# Altium schematic sheet 充电安全回路.SchDoc
size A4; SheetNumber: 6; SheetTotal: 9
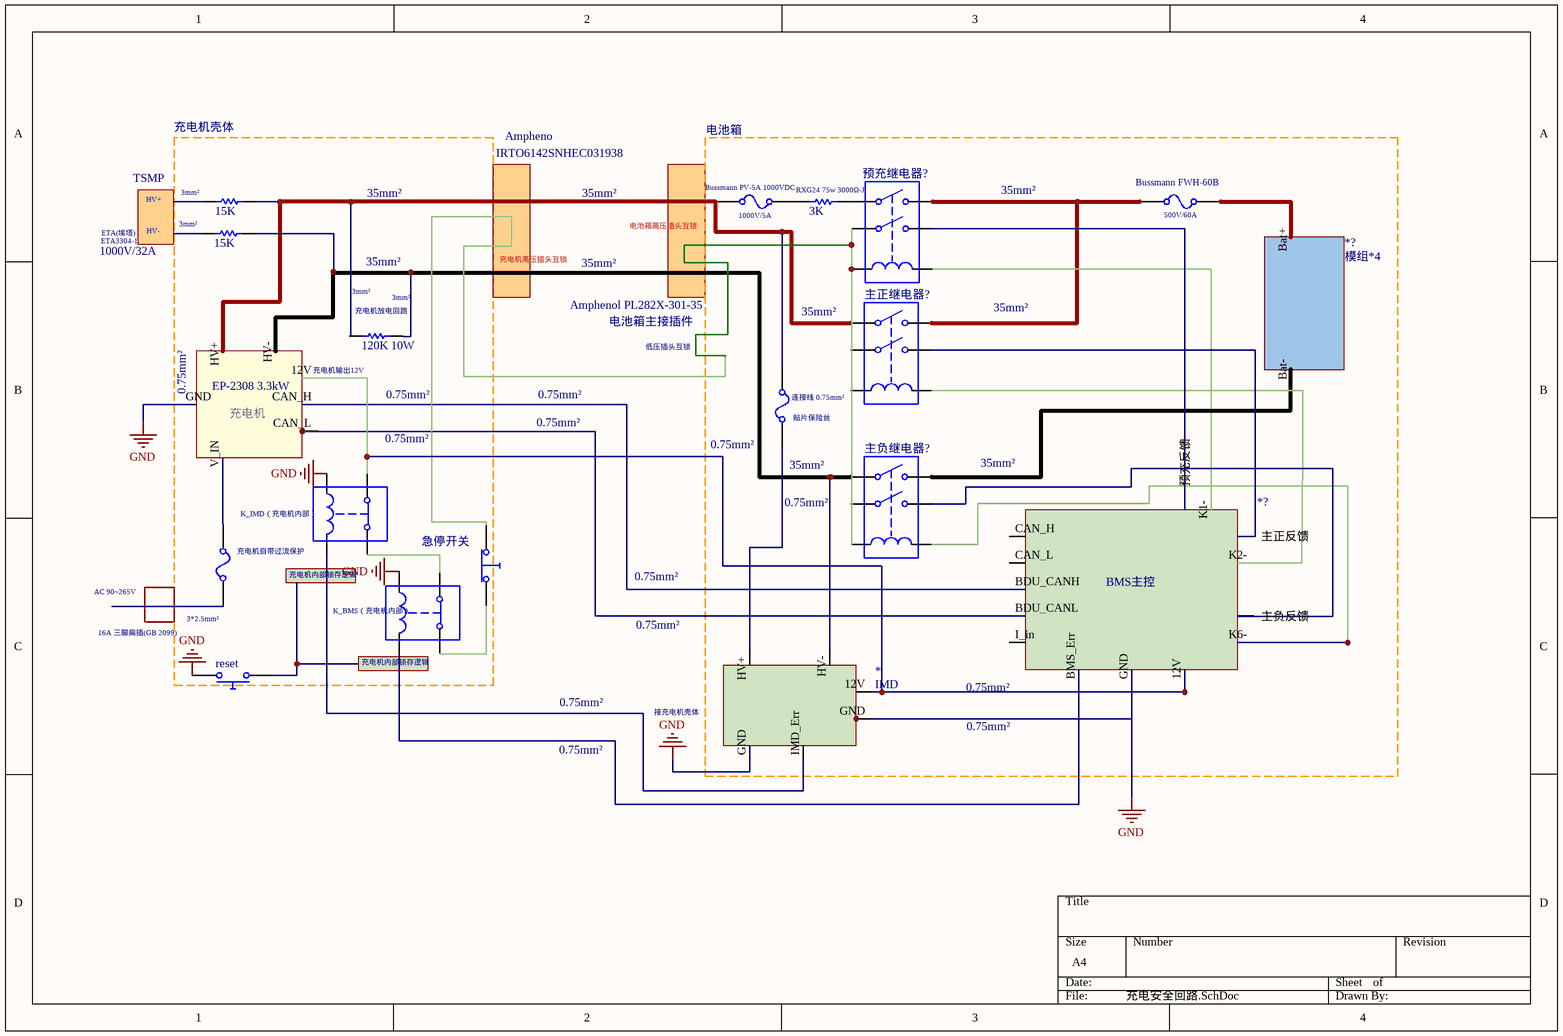
[diagram p0: 充电安全回路.SchDoc]

## Parts
(Parts that share a designator on the sheet are numbered #1, #2 ... from top to bottom, then left to right.)
*  IMD
*?#1  模组*4
*?#2  EP-2308 3.3kW
*?#3  BMS主控
?  value 120K 10W  (hidden comment: Resistor)
Bussmann_FWH-60B  Fuse  (value not drawn)
Bussmann_PV-5A_1000VDC  Fuse  (value not drawn)
K_BMS（充电机内部）  Single-Pole, Single-Throw Normally Closed Relay  (value not drawn)
K_IMD（充电机内部）  Single-Pole, Single-Throw Normally Closed Relay  (value not drawn)
R?#1  value 15K  (hidden comment: Resistor)
R?#2  value 15K  (hidden comment: Resistor)
reset  Push Button Normally Opened  (value not drawn)
RXG24_75w_3000Ω-J  value 3K  (hidden comment: Resistor)
主正继电器?  Double-Pole, Single-Throw Relay  (value not drawn)
主负继电器?  Double-Pole, Single-Throw Relay  (value not drawn)
充电机自带过流保护  Fuse  (value not drawn)
急停开关  Push Button Normally Closed  (value not drawn)
贴片保险丝  连接线 0.75mm²
预充继电器?  Double-Pole, Single-Throw Relay  (value not drawn)

## Nets
GND: *.GND *?#2.GND *?#3.GND K_BMS（充电机内部）.3 K_IMD（充电机内部）.3 reset.2
Net*?#1_Bat+: *?#1.Bat+ Bussmann_FWH-60B.2
Net*?#1_Bat-: *?#1.Bat- 主负继电器?.2
Net*?#2_CAN_H: *?#2.CAN_H *?#3.BDU_CANH
Net*?#2_CAN_L: *?#2.CAN_L *?#3.BDU_CANL
Net*?#2_HV+: *?#2.HV+ ?.1 Bussmann_PV-5A_1000VDC.1 R?#1.2 主正继电器?.1 贴片保险丝.2
Net*?#2_V_IN: *?#2.V_IN 充电机自带过流保护.2
Net*?#3_?1: *?#3.?1(主负反馈) 主负继电器?.4
Net*?#3_?2: *?#3.?2(主正反馈) 主正继电器?.4
Net*?#3_?3: *?#3.?3(预充反馈) 预充继电器?.4
Net*?#3_BMS_Err: *?#3.BMS_Err K_BMS（充电机内部）.4
Net*?#3_K1-: *?#3.K1- 预充继电器?.6
Net*?#3_K2-: *?#3.K2- 主正继电器?.6
Net*?#3_K6-: *?#3.K6- 主负继电器?.6
Net*_12V: *.12V *?#2.12V *?#3.12V K_IMD（充电机内部）.1
Net*_HV+: *.HV+ 贴片保险丝.1
Net*_HV-: *.HV- *?#2.HV- ?.2 R?#2.1 主负继电器?.1
Net*_IMD_Err: *.IMD_Err K_IMD（充电机内部）.4
NetBussmann_FWH-60B_1: Bussmann_FWH-60B.1 主正继电器?.2 预充继电器?.2
NetBussmann_PV-5A_1000VDC_2: Bussmann_PV-5A_1000VDC.2 RXG24_75w_3000Ω-J.1
NetK_BMS（充电机内部）_1: K_BMS（充电机内部）.1 K_IMD（充电机内部）.2
NetK_BMS（充电机内部）_2: K_BMS（充电机内部）.2 急停开关.2
NetRXG24_75w_3000Ω-J_2: RXG24_75w_3000Ω-J.2 预充继电器?.1
Net主负继电器?_5: 主负继电器?.5 急停开关.1 预充继电器?.3 预充继电器?.5

Not connected (* = marked no-connect by the designer): *?#3 CAN_H CAN_L I_in; R?#1 1; R?#2 2; reset 1; 主正继电器? 3 5; 主负继电器? 3; 充电机自带过流保护 1

## Notes on the sheet
- TSMP
- 充电机壳体
- IRTO6142SNHEC031938
- Ampheno
- 电池箱
- ETA3304-1
- ETA(埃塔)
- HV+
- HV-
- (near R?#2) 3mm²
- (near R?#1) 3mm²
- 35mm²
- 电池箱高压插头互锁
- (near Bussmann_PV-5A_1000VDC) 1000V/5A
- (near Bussmann_FWH-60B) 500V/60A
- 1000V/32A
- (near *?#2) 3mm²
- (near *?#2) 充电机放电回路
- 3mm²
- 充电机高压插头互锁
- Amphenol PL282X-301-35
- (near *?#2) 充电机输出12V
- 电池箱主接插件
- 低压插头互锁
- (near *?#2) 0.75mm²
- (near *?#2) 充电机
- 0.75mm²
- (near 贴片保险丝) 0.75mm²
- (near 主负继电器?) 0.75mm²
- (near *?#3) 35mm²
- (near K_IMD（充电机内部）) 充电机内部锁存逻辑
- AC 90~265V
- 16A 三脚扁插(GB 2099)
- 3*2.5mm²
- (near K_BMS（充电机内部）) 充电机内部锁存逻辑
- 接充电机壳体
- (near *?#3) 0.75mm²

## Library data of the parts
? R?#1 R?#2 RXG24_75w_3000Ω-J = Resistor: TC1: 0; SimulationGenericComponent: True; TC2: 0
Bussmann_FWH-60B Bussmann_PV-5A_1000VDC 充电机自带过流保护 贴片保险丝 = Fuse: RESISTANCE: 1m; SimulationGenericComponent: True; CURRENT: 1
K_BMS（充电机内部） K_IMD（充电机内部） = SPST Relay NC: L_C: 1u; R_C: 100; RON: 1; ROFF: 1e12; ION: 1m; IOFF: 0; SimulationGenericComponent: True
reset = Push Button NO: closed: 0; Rclosed: 1m; Ropen: 1Meg; SimulationGenericComponent: True
主正继电器? 主负继电器? 预充继电器? = DPST Relay: L_C: 1u; R_C: 100; RON: 1; ROFF: 1e12; ION: 1m; IOFF: 0; SimulationGenericComponent: True
急停开关 = Push Button NC: closed: 1; Rclosed: 1m; Ropen: 1Meg; SimulationGenericComponent: True